# EAGLE design THAT1512  INA128 input NEVIN v4 (EAGLE 9.6.1)
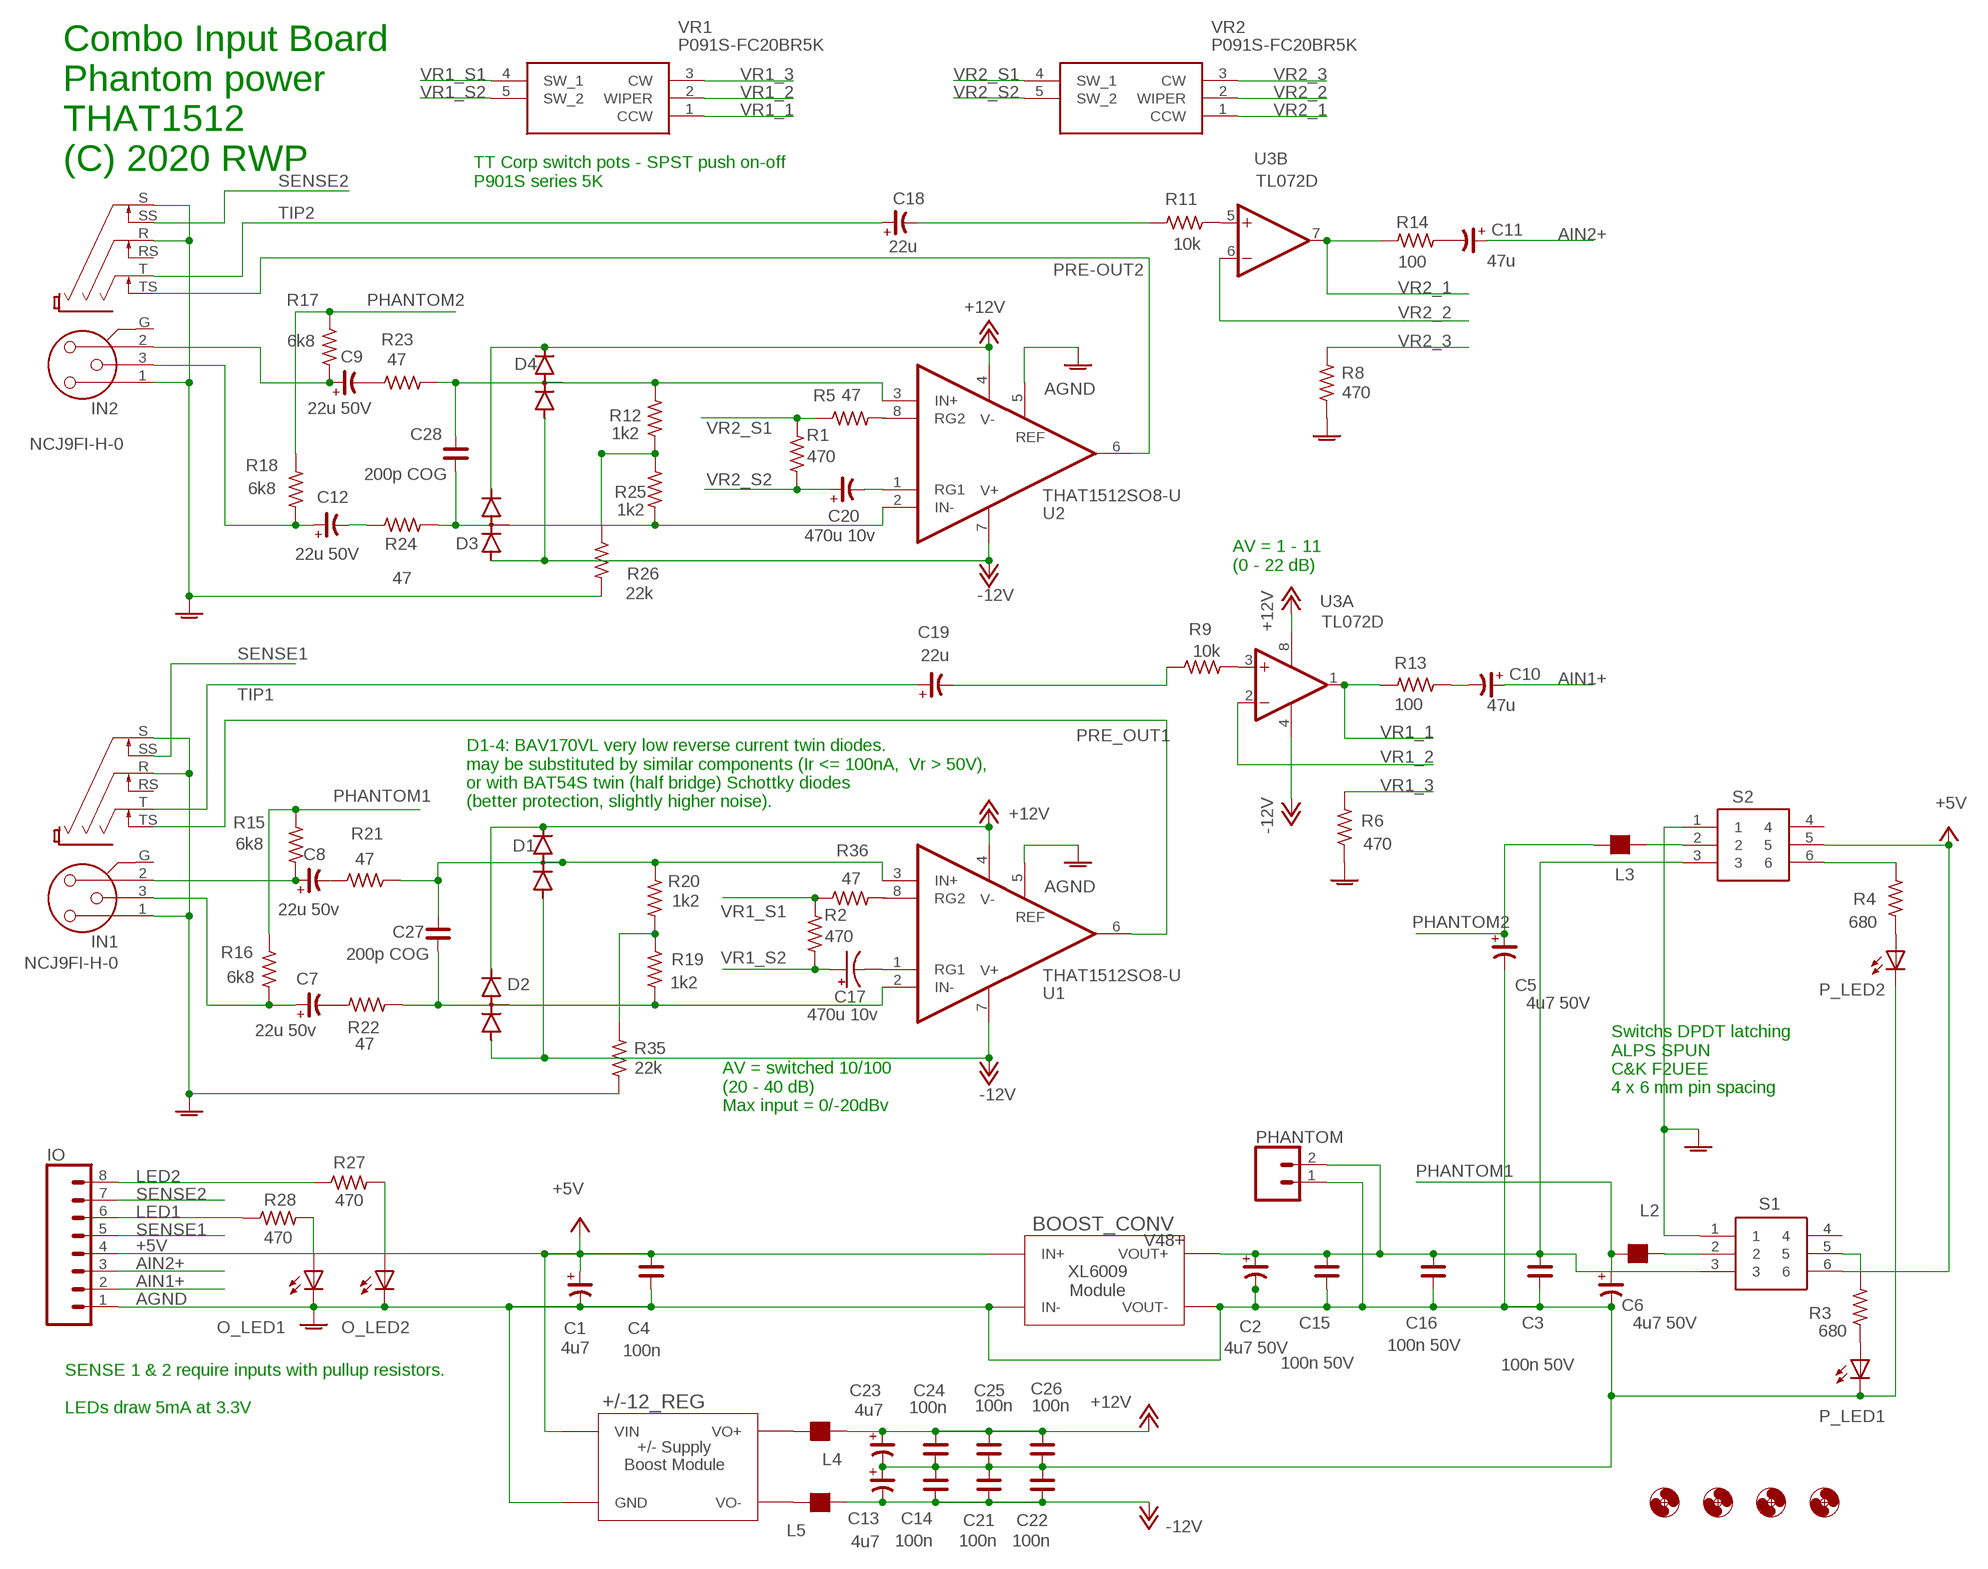
[diagram p0: schematic, sheet 1]

## Parts
+/-12_REG  POS_NEG_SUP_MODULE  [POS_NEG_SUP_MODULE_F]
BOOST_CONV  XL6009_MODULE  [XL6009_MODULE_F]
C1  4u7  CP_3216  [C3216/T]
C2  4u7 50V  CP_3216  [C3216/T]
C3  100n 50V  C_0805  [C0805]
C4  100n  C_0805  [C0805]
C5  4u7 50V  CP_3216  [C3216/T]
C6  4u7 50V  CP_3216  [C3216/T]
C7  22u 50v  CP_SV-C  [CSV-C]
C8  22u 50v  CP_SV-C  [CSV-C]
C9  22u 50V  CP_SV-C  [CSV-C]
C10  47u  CP_SV-B  [CSV-B]
C11  47u  CP_SV-B  [CSV-B]
C12  22u 50V  CP_SV-C  [CSV-C]
C13  4u7  CP_3216  [C3216/T]
C14  100n  C_0805  [C0805]
C15  100n 50V  C_0805  [C0805]
C16  100n 50V  C_0805  [C0805]
C17  470u 10v  CPOL-US153CLV-0605  [153CLV-0605]
C18  22u  CP_SV-B  [CSV-B]
C19  22u  CP_SV-B  [CSV-B]
C20  470u 10v  CP_SV-C  [CSV-C]
C21  100n  C_0805  [C0805]
C22  100n  C_0805  [C0805]
C23  4u7  CP_3216  [C3216/T]
C24  100n  C_0805  [C0805]
C25  100n  C_0805  [C0805]
C26  100n  C_0805  [C0805]
C27  200p COG  C_0805  [C0805]
C28  200p COG  C_0805  [C0805]
D1  HSMS-285C  [SOT323]
D2  HSMS-285C  [SOT323]
D3  HSMS-285C  [SOT323]
D4  HSMS-285C  [SOT323]
H1  MOUNT-HOLE3.6  [3,6]
H2  MOUNT-HOLE3.6  [3,6]
H3  MOUNT-HOLE3.6  [3,6]
H4  MOUNT-HOLE3.6  [3,6]
IN1  NCJ9FI-H-0  [NCJ9FI-H]
IN2  NCJ9FI-H-0  [NCJ9FI-H]
IO  CONN_08"  [1X08]
L2  150  FB_0805  [L0805]
L3  150  FB_0805  [L0805]
L4  150  FB_0805  [L0805]
L5  150  FB_0805  [L0805]
O_LED1  LED3MM  [LED3MM]
O_LED2  LED3MM  [LED3MM]
P_LED1  LED3MM  [LED3MM]
P_LED2  LED3MM  [LED3MM]
PHANTOM  CONN_02  [1X02]
R1  470  R_0805  [R0805]
R2  470  R_0805  [R0805]
R3  680  R_0805  [R0805]
R4  680  R_0805  [R0805]
R5  47  R_0805  [R0805]
R6  470  R_0805  [R0805]
R8  470  R_0805  [R0805]
R9  10k  R_0805  [R0805]
R11  10k  R_0805  [R0805]
R12  1k2  R_0805  [R0805]
R13  100  R_0805  [R0805]
R14  100  R_0805  [R0805]
R15  6k8  R_0805  [R0805]
R16  6k8  R_0805  [R0805]
R17  6k8  R_0805  [R0805]
R18  6k8  R_0805  [R0805]
R19  1k2  R_0805  [R0805]
R20  1k2  R_0805  [R0805]
R21  47  R_0805  [R0805]
R22  47  R_0805  [R0805]
R23  47  R_0805  [R0805]
R24  47  R_0805  [R0805]
R25  1k2  R_0805  [R0805]
R26  22k  R_0805  [R0805]
R27  470  R_0805  [R0805]
R28  470  R_0805  [R0805]
R35  22k  R_0805  [R0805]
R36  47  R_0805  [R0805]
S1  SPUN191600  [SPUN191000]
S2  SPUN191600  [SPUN191000]
U1  THAT1512SO8-U  [SO08]
U2  THAT1512SO8-U  [SO08]
U3  TL072D  [SO08]
VR1  P091S-FC20BR5K  [P091SFC20BR5K]
VR2  P091S-FC20BR5K  [P091SFC20BR5K]

## Nets
+5V [power]: +/-12_REG.IN+(VIN) BOOST_CONV.IN+ C1.+ C4.2 IO.4 S1.6 S2.5
+12V: C23.+ C24.2 C25.2 C26.2 D1.2(C) D2.2(C) D3.2(C) D4.2(C) L4.1 U1.4(V-) U2.4(V-) U3.8(P:V+)
-12V: C13.- C14.1 C21.1 C22.1 D1.1(A) D2.1(A) D3.1(A) D4.1(A) L5.1 U1.7(V+) U2.7(V+) U3.4(P:V-)
AGND: +/-12_REG.GND +/-12_REG.GND@1(GND) BOOST_CONV.IN- BOOST_CONV.VOUT- C1.- C2.- C3.1 C4.1 C5.- C6.- C13.+ C14.2 C15.1 C16.1 C21.2 C22.2 C23.- C24.1 C25.1 C26.1 IN1.1 IN1.R IN1.S IN2.1 IN2.R IN2.S IO.1 O_LED1.K(C) O_LED2.K(C) P_LED1.K(C) P_LED2.K(C) PHANTOM.1 R6.2 R8.2 R26.2 R35.2 S1.1 S2.1 U1.5(REF) U2.5(REF)
AIN1+: C10.+ IO.2
AIN2+: C11.+ IO.3
LED1: IO.6 R28.2
LED2: IO.8 R27.2
N$1: C27.2 D1.3(AC) R20.1 R21.1 U1.3(IN+)
N$3: C27.1 D2.3(AC) R19.2 R22.1 U1.2(IN-)
N$4: C28.2 D4.3(AC) R12.1 R23.1 U2.3(IN+)
N$5: R36.2 U1.8(RG2)
N$6: L2.1 S1.2
N$7: P_LED1.A R3.1
N$8: L3.1 S2.2
N$9: R9.1 U3.3(A:+IN)
N$10: P_LED2.A R4.1
N$14: R11.1 U3.5(B:+IN)
N$15: R5.2 U2.8(RG2)
N$16: R3.2 S1.5
N$18: R4.2 S2.6
N$19: C18.- R11.2
N$20: +/-12_REG.VO- L5.2
N$21: C7.- R22.2
N$22: +/-12_REG.VO+ L4.2
N$25: C11.- R14.1
N$26: C10.- R13.1
N$27: C7.+ IN1.3 R16.1
N$28: C8.- R21.2
N$29: C8.+ IN1.2 R15.1
N$30: C9.- R23.2
N$31: C12.- R24.2
N$32: C9.+ IN2.2 R17.1
N$33: C12.+ IN2.3 R18.1
N$34: C28.1 D3.3(AC) R24.1 R25.2 U2.2(IN-)
N$36: C19.- R9.2
N$37: O_LED1.A R28.1
N$38: O_LED2.A R27.1
N$39: R19.1 R20.2 R35.1
N$41: C17.- U1.1(RG1)
N$43: C20.- U2.1(RG1)
N$45: R12.2 R25.1 R26.1
PHANTOM1: C6.+ L2.2 R15.2 R16.2
PHANTOM2: C5.+ L3.2 R17.2 R18.2
PRE-OUT2: IN2.TS U2.6(OUT)
PRE_OUT1: IN1.TS U1.6(OUT)
SENSE1: IN1.SS IO.5
SENSE2: IN2.SS IO.7
TIP1: C19.+ IN1.T
TIP2: C18.+ IN2.T
V48+ [power]: BOOST_CONV.VOUT+ C2.+ C3.2 C15.2 C16.2 PHANTOM.2 S1.3 S2.3
VR1_1: R13.2 U3.1(A:OUT) VR1.1(CCW)
VR1_2: U3.2(A:-IN) VR1.2(WIPER)
VR1_3: R6.1 VR1.3(CW)
VR1_S1: R2.1 R36.1 VR1.4(SW_1)
VR1_S2: C17.+ R2.2 VR1.5(SW_2)
VR2_1: R14.2 U3.7(B:OUT) VR2.1(CCW)
VR2_2: U3.6(B:-IN) VR2.2(WIPER)
VR2_3: R8.1 VR2.3(CW)
VR2_S1: R1.1 R5.1 VR2.4(SW_1)
VR2_S2: C20.+ R1.2 VR2.5(SW_2)
Unconnected: IN1.G IN1.RS IN2.G IN2.RS S1.4 S2.4

## Notes on the sheet
- Combo Input Board
  Phantom power
  THAT1512
  (C) 2020 RWP
- TT Corp switch pots - SPST push on-off
  P901S series 5K
- AV = 1 - 11 
  (0 - 22 dB)
- D1-4: BAV170VL very low reverse current twin diodes. 
  may be substituted by similar components (Ir <= 100nA,  Vr > 50V), 
  or with BAT54S twin (half bridge) Schottky diodes 
  (better protection, slightly higher noise).
- Switchs DPDT latching
  ALPS SPUN
  C&K F2UEE  
  4 x 6 mm pin spacing
- AV = switched 10/100
  (20 - 40 dB)
  Max input = 0/-20dBv
- SENSE 1 & 2 require inputs with pullup resistors.
  
  LEDs draw 5mA at 3.3V

## Library data of the parts
+/-12_REG = pos_Neg_supply_module:POS_NEG_SUP_MODULE
BOOST_CONV = XL6009_module:XL6009_MODULE
C1 C2 C5-C13 C18-C20 C23 = rc-master-smd:CP_: POLARIZED CAP
C3 C4 C14-C16 C21 C22 C24-C28 = rc-master-smd:C_: NON-POLARIZED CAP
C17 = rcl:CPOL-US: POLARIZED CAPACITOR, American symbol; SPICEPREFIX: C
D1-D4 = avago:HSMS-285C: Surface Mount Microwave Schottky Detector Diodes Source: Data sheet <http://www.farnell.com/datasheets/461166.pdf>
H1-H4 = holes:MOUNT-HOLE: MOUNTING HOLE with drill center marker
IN1 IN2 = con-neutrik_xlr_2:NCJ9FI: NCJ9FI Combination - 3 pin Female XLR - 3 pin 1/4" switched socket Combo I series Without or without retention latch Source: www.neutrik.com/
IO = SparkFun-Connectors:CONN_08: Multi connection point. Often used as Generic Header-pin footprint for 0.1 inch spaced/style header connections On any of the 0.1 inch spaced packages, you can populate with these: Break Away Headers - Straight <https://www.sparkfun.com/products/116> (PRT-00116) Break Away Male Headers - Right Angle <https://www.sparkfun.com/products/553> (PRT-00553) Female Headers <https://www.sparkfun.com/products/115> (PRT-00115) Break Away Headers - Machine Pin <https://www.sparkfun.com/products/117> (PRT-00117) Break Away Female Headers - Swiss Machine Pin <https://www.sparkfun.com/products/743> (PRT-00743) Arduino Stackable Header - 8 Pin <https://www.sparkfun.com/products/9279> (PRT-09279) For SCREWTERMINALS and SPRING TERMINALS visit here: Screw Terimnals on SparkFun.com <https://www.sparkfun.com/search/results?term=Screw+Terminals> (5mm/3.5mm/2.54mm spacing) This device is also useful as a general connection point to wire up your design to another part of your project. Our various solder wires solder well into these plated through hole pads. Hook-Up Wire - Assortment (Stranded, 22 AWG) <https://www.sparkfun.com/products/11375> (PRT-11375) Hook-Up Wire - Assortment (Solid Core, 22 AWG) <https://www.sparkfun.com/products/11367> (PRT-11367) View the entire wire category on our website here <https://www.sparkfun.com/categories/141> Special notes: Molex polarized connector foot print use with SKU : PRT-08231 with associated crimp pins and housings. 1MM SMD Version SKU: PRT-10208 NOTES ON THE VARIANTS LOCK and LOCK_LONGPADS... This footprint was designed to help hold the alignment of a through-hole component (i.e. 6-pin header) while soldering it into place. You may notice that each hole has been shifted either up or down by 0.005 of an inch from it's more standard position (which is a perfectly straight line). This slight alteration caused the pins (the squares in the middle) to touch the edges of the holes. Because they are alternating, it causes a "brace" to hold the component in place. 0.005 has proven to be the perfect amount of "off-center" position when using our standard breakaway headers. Although looks a little odd when you look at the bare footprint, once you have a header in there, the alteration is very hard to notice. Also,if you push a header all the way into place, it is covered up entirely on the bottom side.; PROD_ID: CONN-08438
L2-L5 = rc-master-smd:FB_: FERRITE BEAD
O_LED1 O_LED2 P_LED1 P_LED2 = adafruit:LED: LED OSRAM: - CHIPLED LG R971, LG N971, LY N971, LG Q971, LY Q971, LO R971, LY R971 LH N974, LH R974 LS Q976, LO Q976, LY Q976 LO Q996 - Hyper CHIPLED LW Q18S LB Q993, LB Q99A, LB R99A - SideLED LS A670, LO A670, LY A670, LG A670, LP A670 LB A673, LV A673, LT A673, LW A673 LH A674 LY A675 LS A676, LA A676, LO A676, LY A676, LW A676 LS A679, LY A679, LG A679 - Hyper Micro SIDELED® LS Y876, LA Y876, LO Y876, LY Y876 LT Y87S - SmartLED LW L88C, LW L88S LB L89C, LB L89S, LG L890 LS L89K, LO L89K, LY L89K LS L896, LA L896, LO L896, LY L896 - TOPLED LS T670, LO T670, LY T670, LG T670, LP T670 LSG T670, LSP T670, LSY T670, LOP T670, LYG T670 LG T671, LOG T671, LSG T671 LB T673, LV T673, LT T673, LW T673 LH T674 LS T676, LA T676, LO T676, LY T676, LB T676, LH T676, LSB T676, LW T676 LB T67C, LV T67C, LT T67C, LS T67K, LO T67K, LY T67K, LW E67C LS E67B, LA E67B, LO E67B, LY E67B, LB E67C, LV E67C, LT E67C LW T67C LS T679, LY T679, LG T679 LS T770, LO T770, LY T770, LG T770, LP T770 LB T773, LV T773, LT T773, LW T773 LH T774 LS E675, LA E675, LY E675, LS T675 LS T776, LA T776, LO T776, LY T776, LB T776 LHGB T686 LT T68C, LB T68C - Hyper Mini TOPLED® LB M676 - Mini TOPLED Santana® LG M470 LS M47K, LO M47K, LY M47K Source: http://www.osram.convergy.de/
PHANTOM = SparkFun-Connectors:CONN_02: Multi connection point. Often used as Generic Header-pin footprint for 0.1 inch spaced/style header connections On any of the 0.1 inch spaced packages, you can populate with these: Break Away Headers - Straight <https://www.sparkfun.com/products/116> (PRT-00116) Break Away Male Headers - Right Angle <https://www.sparkfun.com/products/553> (PRT-00553) Female Headers <https://www.sparkfun.com/products/115> (PRT-00115) Break Away Headers - Machine Pin <https://www.sparkfun.com/products/117> (PRT-00117) Break Away Female Headers - Swiss Machine Pin <https://www.sparkfun.com/products/743> (PRT-00743) For SCREWTERMINALS and SPRING TERMINALS visit here: Screw Terimnals on SparkFun.com <https://www.sparkfun.com/search/results?term=Screw+Terminals> (5mm/3.5mm/2.54mm spacing) This device is also useful as a general connection point to wire up your design to another part of your project. Our various solder wires solder well into these plated through hole pads. Hook-Up Wire - Assortment (Stranded, 22 AWG) <https://www.sparkfun.com/products/11375> (PRT-11375) Hook-Up Wire - Assortment (Solid Core, 22 AWG) <https://www.sparkfun.com/products/11367> (PRT-11367) View the entire wire category on our website here <https://www.sparkfun.com/categories/141> Special notes: Molex polarized connector foot print use with: PRT-08233 with associated crimp pins and housings. 2.54_SCREWTERM for use with PRT-10571. 3.5mm Screw Terminal footprints for PRT-08084 5mm Screw Terminal footprints for use with PRT-08432
R1-R6 R8 R9 R11-R28 R35 R36 = rc-master-smd:R_: RESISTOR
S1 S2 = SamacSys_Parts:SPUN191600: Double Pole Double Throw (DPDT) Latching Push Button Switch, PCB Source: Datasheet <https://componentsearchengine.com/Datasheets/1/SPUN191600.pdf>; DESCRIPTION: Double Pole Double Throw (DPDT) Latching Push Button Switch, PCB; HEIGHT: mm; MANUFACTURER_NAME: ALPS; MANUFACTURER_PART_NUMBER: SPUN191600; MOUSER_PART_NUMBER: 688-SPUN191600; MOUSER_PRICE-STOCK: https://www.mouser.com/Search/Refine.aspx?Keyword=688-SPUN191600
U1 U2 = that-corp:THAT1512: Audio Preamplifier IC, Low Noise, High Performance
U3 = linear:TL072: OP AMP
VR1 VR2 = SamacSys_Parts:P091S-FC20BR5K: POTENTIOMETER Source: Datasheet <https://componentsearchengine.com/Datasheets/1/P091S-FC20BR5K.pdf>; DESCRIPTION: POTENTIOMETER; HEIGHT: 11.35mm; MANUFACTURER_NAME: BI Technologies; MANUFACTURER_PART_NUMBER: P091S-FC20BR5K; MOUSER_PART_NUMBER: 858-P091SFC20BR5K; MOUSER_PRICE-STOCK: https://www.mouser.com/Search/Refine.aspx?Keyword=858-P091SFC20BR5K

## Net classes
3 power: width 0.406 mm

## Board
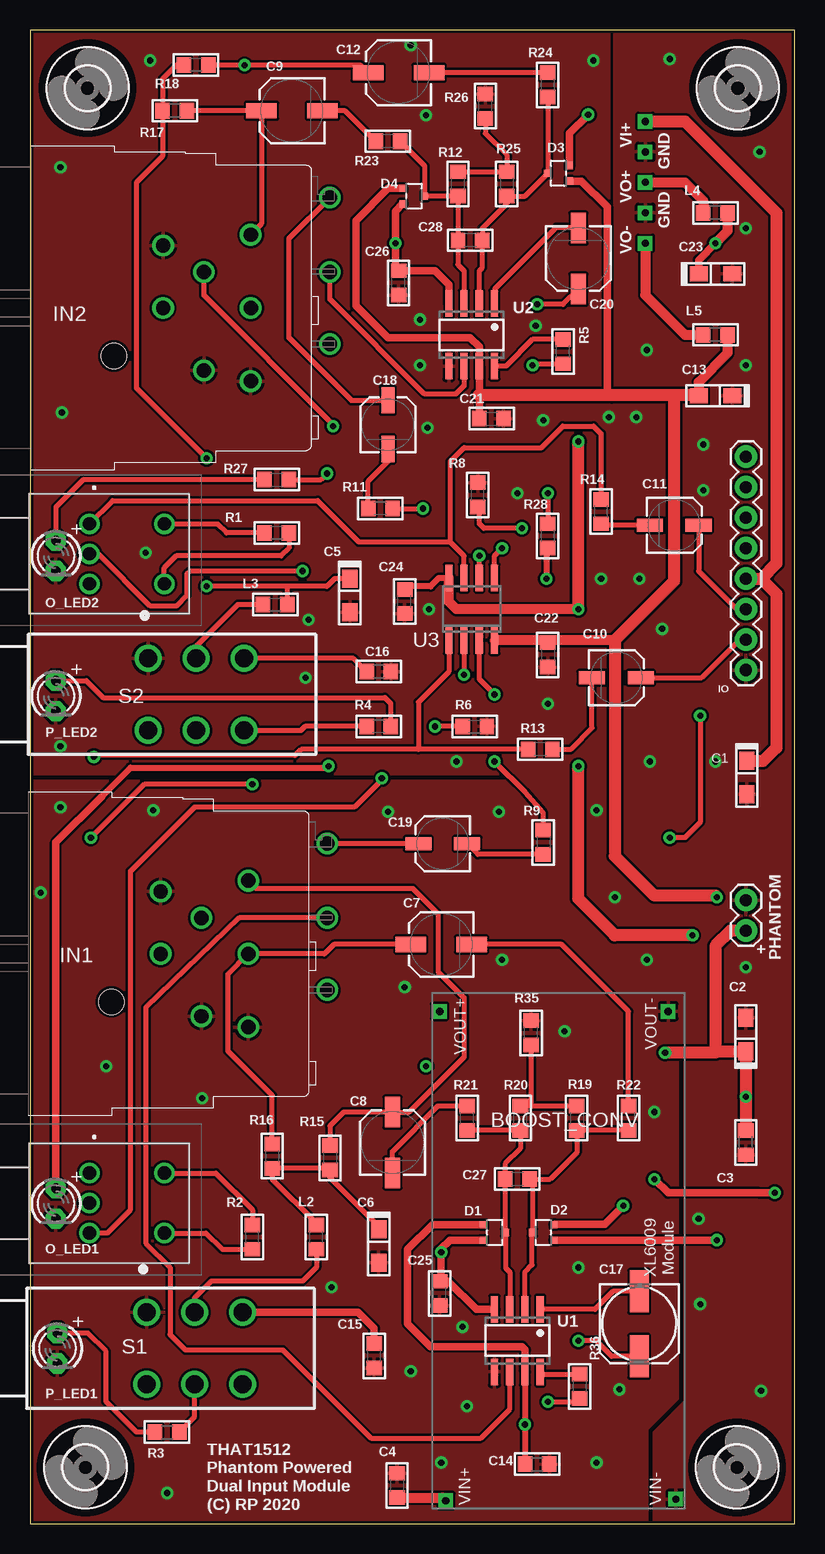
[diagram p1: board, top side]
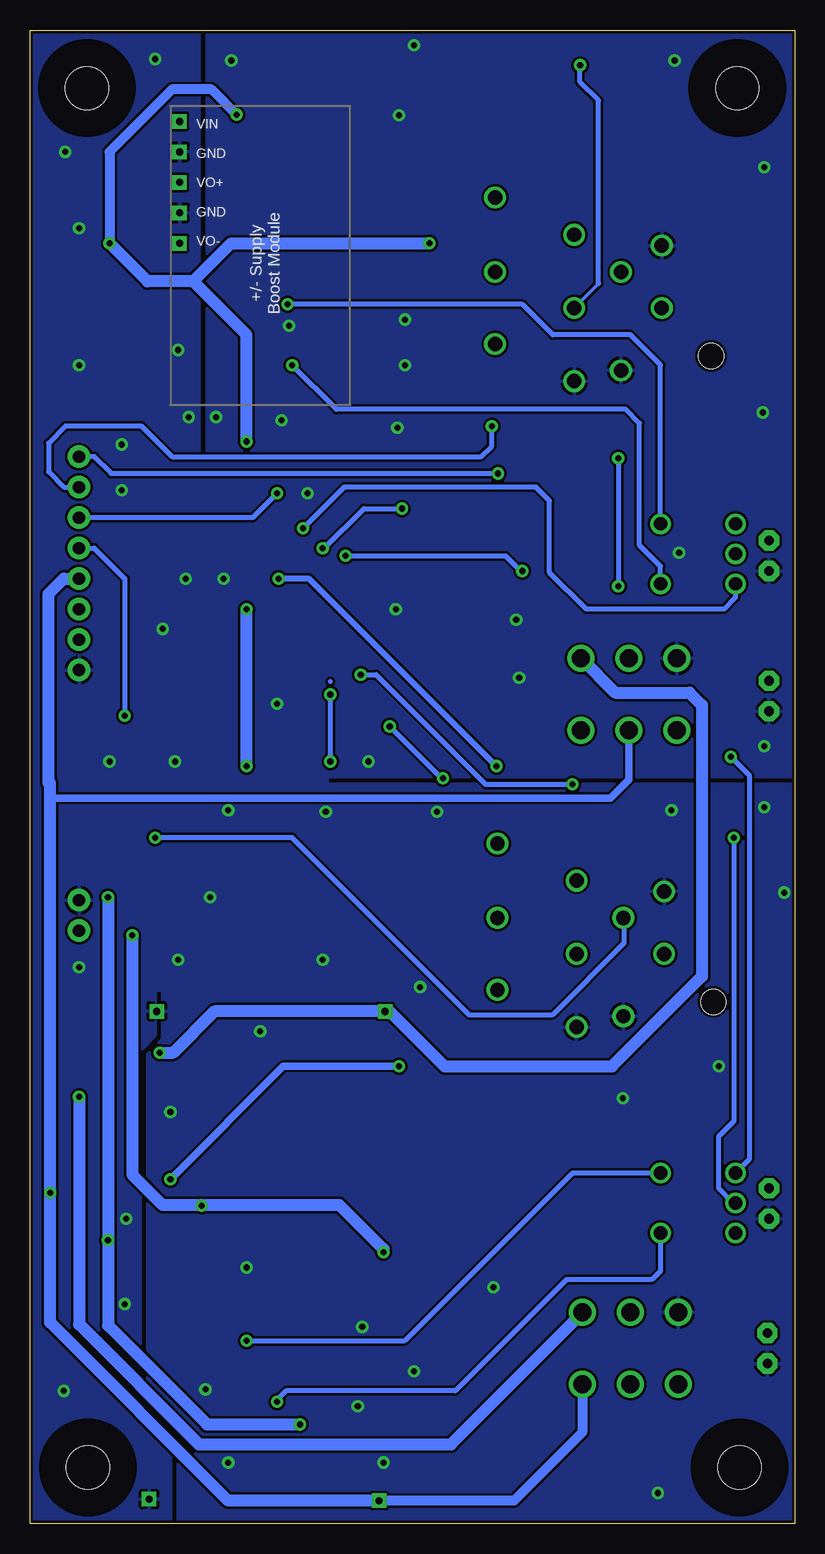
[diagram p2: board, bottom side, seen from below]

Size 63.78 x 124.46 mm. Coordinates in mm from the lower left corner, seen from the top.
Outline: 0,0 63.78,0 63.78,124.46 0,124.46 0,0
Copper layers (1*16): Top 0.035mm / dielectric 1.5mm / Bottom 0.035mm
Design rules "SparkFun": minimum track width 8mil, minimum drill 20mil, track to track 8mil, track to pad 8mil, pad to pad 8mil, via to via 8mil, smd to smd 8mil, copper to edge 10mil, drill to drill 8mil, minimum pad ring 12mil, minimum via ring 10mil, stop-mask expansion 4mil, vias tented up to drill 25mil, thermal gap 10mil

### Footprints (pad centres in the part's own frame; a part is rotated, then mirrored left to right if it is on the bottom)
POS_NEG_SUP_MODULE_F = drill 0.6 square: GND 3.81,0.762; GND@1 8.89,0.762; IN+ 1.27,0.762; VO+ 6.35,0.762; VO- 11.43,0.762
XL6009_MODULE_F = drill 0.6 square: IN+ 0.635,19.939; IN- 0.762,0.762; VOUT+ 41.402,20.447; VOUT- 41.402,1.397
C3216/T = smd 1.5 x 1.27: + 1.397,0; - -1.397,0
C0805 = smd 1.2 x 1.3: 1 -1.016,0; 2 1.016,0
CSV-C = smd 2.54 x 1.27: + -2.54,0; - 2.54,0
CSV-B = smd 2.184 x 1.067: + -2.032,0; - 2.032,0
153CLV-0605 = smd 3.5 x 1.6: + 2.7,0; - -2.7,0
SOT323 = smd 0.6 x 0.55: 1 -0.65,-0.925; 2 0.65,-0.925; 3 0,0.925
3,6 = hole 3.6: 0,0
NCJ9FI-H = drill 1.2: 1 -6.1,-18.4; 2 6.1,-18.4; 3 0,-18.4; G 0,-11.1; R -5.2,-14.5; RS -3,-25; S 5.2,-11.1; SS 3,-14.5; T 9.2,-25; TS 3,-25 | hole 2.1: -4,-7
1X08 = drill 1.016 pad 1.88: 1 0,0; 2 2.54,0; 3 5.08,0; 4 7.62,0; 5 10.16,0; 6 12.7,0; 7 15.24,0; 8 17.78,0
L0805 = smd 1.2 x 1.3: 1 -1.016,0; 2 1.016,0
LED3MM = drill 0.813 pad 1.676 octagon: A -1.27,0; K 1.27,0
1X02 = drill 1.016 pad 1.88: 1 0,0; 2 2.54,0
R0805 = smd 1.2 x 1.3: 1 -1.016,0; 2 1.016,0
SPUN191000 = drill 1.5 pad 2.25: 1 3,-19.5; 2 3,-23.5; 3 3,-27.5; 4 -3,-19.5; 5 -3,-23.5; 6 -3,-27.5
SO08 = smd 0.6 x 2.2: 1 -1.905,-2.6; 2 -0.635,-2.6; 3 0.635,-2.6; 4 1.905,-2.6; 5 1.905,2.6; 6 0.635,2.6; 7 -0.635,2.6; 8 -1.905,2.6
P091SFC20BR5K = drill 1.1 pad 1.65: 1 0,0; 2 0,2.5; 3 0,5; 4 -6.25,5; 5 -6.25,0

### Placement (x,y rotation side)
+/-12_REG  52.07,118.11 270 bottom
BOOST_CONV  54.61,1.27 90 top
C1  59.77,62.15 90 top
C2  59.69,40.77 270 top
C3  59.69,31.75 90 top
C4  30.61,3.17 270 top
C5  26.67,77.34 90 top
C6  29.08,23.11 90 top
C7  34.29,48.26 0 top
C8  30.23,31.75 270 top
C9  21.84,117.73 0 top
C10  48.9,70.48 180 top
C11  53.72,83.19 180 top
C12  30.73,120.9 0 top
C13  57.15,93.98 0 top
C14  42.29,4.95 0 top
C15  28.7,13.97 90 top
C16  29.08,70.99 180 top
C17  50.8,16.64 270 top
C18  29.84,91.57 270 top
C19  34.42,56.64 0 top
C20  45.72,105.41 90 top
C21  38.48,92.07 0 top
C22  43.18,72.39 270 top
C23  57.15,104.14 180 top
C24  31.24,76.84 90 top
C25  34.16,19.18 90 top
C26  30.73,103.38 90 top
C27  40.64,28.7 180 top
C28  36.7,106.93 180 top
D1  38.73,24.26 270 top
D2  42.8,24.26 90 top
D3  44.07,112.52 90 top
D4  32,110.62 270 top
H1  4.62,4.67 0 top
H2  4.8,119.61 0 top
H3  59.03,119.61 0 top
H4  58.95,4.67 0 top
IN1  -0.2,47.47 90 top
IN2  0,101.3 90 top
IO  59.69,71.12 90 top
L2  23.88,23.88 90 top
L3  20.45,76.58 0 top
L4  57.15,109.22 180 top
L5  57.15,99.06 180 top
O_LED1  2.16,26.67 270 top
O_LED2  2.16,80.65 270 top
P_LED1  2.29,14.61 270 top
P_LED2  2.16,68.96 270 top
PHANTOM  59.69,51.94 270 top
R1  20.57,82.55 180 top
R2  18.54,23.88 90 top
R3  11.43,7.62 0 top
R4  29.08,66.42 180 top
R5  44.45,97.66 90 top
R6  37.08,66.42 0 top
R8  37.34,85.72 90 top
R9  42.8,56.77 270 top
R11  29.21,84.58 180 top
R12  35.69,111.63 90 top
R13  42.55,64.52 180 top
R14  47.62,84.33 90 top
R15  25.02,30.48 270 top
R16  20.19,30.61 270 top
R17  12.06,117.73 180 top
R18  13.84,121.54 180 top
R19  45.59,33.78 270 top
R20  40.89,33.78 90 top
R21  36.45,33.78 90 top
R22  49.91,33.78 90 top
R23  29.84,115.19 180 top
R24  43.18,119.89 90 top
R25  39.75,111.63 270 top
R26  37.97,118.11 90 top
R27  20.57,87 0 top
R28  43.18,82.3 90 top
R35  41.78,40.89 90 top
R36  45.85,11.43 90 top
S1  -9.78,14.61 90 top
S2  -9.65,69.09 90 top
U1  40.64,15.24 180 top
U2  36.83,99.06 180 top
U3  36.83,76.2 0 top
VR1  4.95,29.21 180 top
VR2  4.95,83.31 180 top

### Tracks (layer width: path | path; a pad name or v marks a point on that pad's centre or on a via)
+5V  (via drill 0.51)
  Top 0.61: 34.42,2.16 BOOST_CONV.IN+ | 60.83,27.56 53.21,27.56 v52.07,28.7 | 60.83,27.56 v62.1,27.56 | 60.83,27.56
  Top 0.813: C4.2 34.42,2.16
  Top 1.016: +/-12_REG.IN+ 54.61,116.84 62.23,109.22 62.23,80.01 60.96,78.74 | IO.4 60.96,78.74 | 60.96,78.74 62.23,77.47 62.23,64.64 61.14,63.55 C1.+
  Bottom 0.61: S2.5 13.85,61.97 15.37,60.45 62.1,60.45 | 62.1,61.72 62.23,61.72 | v33.02,38.1 42.67,38.1 v52.07,28.7
  Bottom 0.813: BOOST_CONV.IN+ 23.42,1.9 17.72,7.6 S1.6
  Bottom 1.016: BOOST_CONV.IN+ 47.24,1.9 62.1,16.76 v62.1,27.56 62.1,60.45 62.1,61.72 | IO.4 60.96,78.74 62.23,77.47 62.23,61.72
+12V  (via drill 0.51)
  Top 0.508: C24.2 31.5,78.1 33.4,78.1 34.1,78.8 U3.8
  Top 0.61: C23.+ 55.75,105.28 v57.15,106.68 | U1.4 37.21,17.84 34.86,20.19 C25.2 34.29,20.32 v34.29,22.61 34.29,22.88 35.01,23.61 D1.2 | v49.46,26.48 47.94,24.95 43.77,24.95 D2.2 | D4.2 30.48,109.37 v30.48,106.68 30.48,104.65 C26.2 33.78,104.39 34.92,103.25 U2.4 | v46.55,117.41 44.99,115.86 D3.2
  Top 0.813: L4.1 58.17,107.7 v57.15,106.68 | U3.8 34.92,76.84 35.56,76.2 v45.72,76.2
  Top 1.016: v45.72,63.12 45.72,52.07 48.77,49.02 v55.24,49.02 | v45.72,76.2 v45.72,90.17
  Bottom 0.406: 49.53,26.54 v49.46,26.48
  Bottom 0.813: v46.55,117.41 48.64,119.51 51.94,119.51 57.15,114.3 v57.15,106.68
  Bottom 1.016: v30.48,106.68 46.99,106.68 50.16,103.5 | 50.16,103.5 53.98,103.5 v57.15,106.68 | v34.29,22.61 34.29,22.86 37.97,26.54 49.53,26.54 52.7,26.54 55.24,29.08 v55.24,49.02 | v45.72,63.12 v45.72,76.2 | 50.16,103.5 45.72,99.06 v45.72,90.17
-12V  (via drill 0.51)
  Top 0.406: 55.82,94.04 C13.-
  Top 0.508: U1.7 v41.27,8.25 C14.1
  Top 0.61: D3.1 45.99,111.87 48.13,109.73 48.13,94.04 | D1.1 33.54,24.91 31.5,22.86 31.5,16.64 33.4,14.73 41.02,14.73 41.27,14.48 U1.7 | 37.47,94.11 U2.7 37.47,98.04 36.7,98.81 29.84,98.81 27.18,101.47 27.18,108.59 29.86,111.27 D4.1 | 37.47,94.11 37.4,94.04 | 37.47,94.11 C21.1 | v57.28,23.62 57.26,23.61 D2.1
  Top 0.813: L5.1 58.17,97.54 55.75,95.12 C13.- | 57.15,52.32 v57.28,52.2 | 48.77,73.6 43.16,73.6 | 43.16,73.6 U3.4 | C22.1 43.16,73.6
  Top 1.016: 37.4,94.04 48.13,94.04 53.72,94.04 | 57.15,52.32 52.07,52.32 48.77,55.63 48.77,73.6 53.72,78.55 53.72,94.04 | 53.72,94.04 55.82,94.04
  Bottom 1.016: v41.27,8.25 49.02,8.25 57.28,16.51 v57.28,23.62 v57.28,52.2
AGND  (via drill 0.51)
  other vias: 2.67,92.58 2.54,113.03 10.03,121.92 31.75,123.19 46.99,121.92 53.34,122.05 60.83,114.3 59.69,96.52 57.15,63.5 59.69,46.35 60.96,11.05 55.88,18.29 11.43,2.54 36.45,9.78 6.35,38.1 0.89,52.58 2.54,59.69 39.37,46.99 39.12,59.31 43.18,68.33 44.58,41.02 52.07,34.29 55.75,25.4 49.15,11.18 47.24,5.08 51.44,46.99 59.69,107.95 51.44,97.79 56.13,89.92 33.27,76.2 25.15,19.69 14.35,35.43 36.07,16.38 34.29,5.08 33.15,91.31 42.8,91.95 33.02,117.35 52.7,74.55 47.24,59.44 51.69,63.5 50.55,92.2 2.54,64.77 50.8,78.74 42.16,99.82 32.51,100.33 32.51,96.52 47.62,78.74 56.13,86.11 45.72,21.34 48.77,52.2 31.24,44.7 31.75,12.7 23.24,75.31 40.64,85.85 48.26,92.2 9.65,80.9 29.84,59.31 10.29,59.44 35.56,63.5 22.99,70.48
  pour Top (rank 3): 63.5,60.96 48.77,60.96 48.77,124.46 63.5,124.46
  pour Top (rank 2): 0,0 51.44,0 51.44,7.87 53.98,10.41 53.98,61.85 0,61.85
  pour Top (rank 2): 0,124.46 48.26,124.46 48.26,62.48 0,62.48
  pour Top: 40.26,93.34 57.15,93.34 57.15,39.5 40.26,39.5
  pour Top (rank 3): 52.07,0 63.5,0 63.5,66.04 54.61,66.04 54.61,10.16 52.07,7.62
  pour Bottom: 52.07,0 63.75,0 63.75,62.23 53.34,62.23 53.34,40.64 54.61,39.37 54.61,10.16 52.07,7.62
  pour Bottom (rank 2): 38.99,90.3 57.15,90.3 57.15,44.45 38.99,44.45
  pour Bottom: 63.75,60.96 49.66,60.96 49.66,124.46 63.75,124.46
  pour Bottom: 0,124.46 49.02,124.46 49.02,62.23 0,62.23
  pour Bottom: 0,0 51.44,0 51.44,7.87 53.98,10.41 53.98,39.12 52.7,40.39 52.7,61.59 0,61.59
AIN1+
  Top 0.406: IO.2 59.18,73.66 56.01,70.48 C10.+
AIN2+
  Top 0.406: IO.3 58.93,76.2 55.75,79.38 C11.+
LED1  (via drill 0.51)
  Top 0.406: v43.18,85.85 R28.2
  Bottom 0.406: IO.6 45.21,83.82 v43.18,85.85
LED2  (via drill 0.51)
  Top 0.406: R27.2 24.26,87 v24.77,87.5
  Bottom 0.406: v24.77,87.5 57.02,87.5 58.42,88.9 IO.8
N$1
  Top 0.406: U1.3 40.01,20.95 39.66,21.3 D1.3 39.62,24.29 C27.2 39.62,29.97 40.89,31.24 R20.1 R21.1
N$3
  Top 0.406: U1.2 41.27,20.95 41.87,21.55 D2.3 41.91,24.29 41.91,28.45 C27.1 43.39,28.7 45.59,30.9 R19.2 R22.1
N$4
  Top 0.406: U2.3 36.2,104.39 35.69,104.9 C28.2 R12.1 D4.3 32.9,110.62 32.9,113.15 R23.1
N$5
  Top 0.406: U1.8 42.74,12.45 R36.2
N$6
  Top 0.406: L2.1 23.88,21.34 22.73,20.19 15.11,20.19 13.72,18.8 S1.2
N$7
  Top 0.406: R3.1 8.89,7.62 6.35,10.16 6.35,14.35 4.83,15.88 P_LED1.A
N$8
  Top 0.406: S2.2 13.85,73.1 17.32,76.58 L3.1
N$9  (via drill 0.51)
  Top 0.406: v38.73,69.09 37.47,70.36 U3.3 | R9.1 42.8,59.22 41.27,60.96 v38.73,63.5
  Bottom 0.406: v38.73,63.5 v38.73,69.09 | 38.73,70.17
N$10
  Top 0.406: R4.1 30.1,68.33 29.59,68.83 6.1,68.83 4.7,70.23 P_LED2.A
N$14  (via drill 0.51)
  Top 0.406: U3.5 38.73,80.65 v39.37,81.28 | R11.1 v32.77,84.58
  Bottom 0.406: v39.37,81.28 39.24,81.28 35.94,84.58 v32.77,84.58
N$15
  Top 0.406: R5.2 41.91,98.68 39.69,96.46 U2.8
N$16
  Top 0.406: R3.2 13.72,8.89 S1.5
N$18
  Top 0.406: R4.2 22.93,66.42 22.59,66.09 S2.6
N$19
  Top 0.406: R11.2 28.19,86.87 29.84,88.52 C18.-
N$20
  Top 0.813: +/-12_REG.VO- 51.31,102.36 54.61,99.06 L5.2
N$21
  Top 0.406: R22.2 49.91,42.67 44.32,48.26 C7.-
N$22
  Top 0.813: +/-12_REG.VO+ 54.61,111.76 56.13,110.24 L4.2
N$25
  Top 0.406: C11.- 47.63,83.19 R14.1
N$26
  Top 0.406: R13.1 45.09,64.52 46.86,66.29 C10.-
N$27
  Top 0.406: R16.1 20.19,35.69 16.51,39.37 16.51,45.79 IN1.3 24.55,47.47 25.33,48.26 C7.+
N$28
  Top 0.406: C8.- 30.23,30.99 34.04,34.8 R21.2
N$29
  Top 0.406: R15.1 25.02,33.15 26.16,34.29 C8.+ 31.62,34.29 36.2,38.86 36.2,43.81 34.04,45.97 34.04,50.8 31.9,52.94 18.83,52.94 IN1.2
N$30
  Top 0.406: R23.2 26.29,117.73 C9.-
N$31
  Top 0.406: R24.2 C12.-
N$32
  Top 0.406: R17.1 C9.+ 19.3,108.3 IN2.2
N$33  (via drill 0.51)
  Top 0.406: R18.1 v17.91,121.54 27.56,121.54 C12.+
  Bottom 0.305: IN2.3 16.38,103.32
  Bottom 0.406: 16.38,103.32 16.38,118.59 17.91,120.12 v17.91,121.54
N$34
  Top 0.406: R24.1 43.18,112.56 D3.3 43.14,112.49 41.27,110.62 R25.2 39.75,109.98 37.72,107.95 C28.1 37.72,104.65 37.47,104.39 U2.2
N$36
  Top 0.406: R9.2 37.34,55.75 C19.-
N$37  (via drill 0.51)
  Top 0.508: 5.97,60.58 8.38,62.99 24.77,62.99 v24.89,63.12 | R28.1 43.05,81.15 v43.05,78.74
  Top 0.61: O_LED1.A 2.16,56.77 5.97,60.58
  Bottom 0.508: v24.89,63.12 40.51,78.74 v43.05,78.74
N$38
  Top 0.406: R27.1 4.45,87 2.16,84.71 O_LED2.A
N$39
  Top 0.406: 41.78,34.8 R20.2 | R35.1 41.78,34.8 | 41.78,34.8 R19.1
N$41
  Top 0.406: C17.- 48.61,19.34 47.12,17.84 U1.1
N$43
  Top 0.406: C20.- 45.68,107.99 43.86,107.99 38.73,102.87 U2.1
N$45
  Top 0.406: R12.2 R25.1 39.75,114.05 37.97,115.82 R26.1
PHANTOM1
  Top 0.406: L2.2 23.88,25.02 20.19,28.7 R16.2 24.89,29.59 R15.2 25.02,28.83 29.08,24.77 C6.+
PHANTOM2  (via drill 0.51)
  Top 0.406: R18.2 12.19,121.54 11.05,120.4 R17.2 11.05,113.92 8.89,111.76 8.89,94.62 v14.73,88.77 | C5.+ 25.4,78.74 24.77,78.1 21.46,78.1 L3.2 21.46,78.1 v14.73,78.1
  Bottom 0.406: v14.73,88.77 v14.73,78.1
PRE-OUT2
  Top 0.406: IN2.TS 25,102.01 32.9,94.11 35.49,94.11 36.2,94.81 U2.6
PRE_OUT1
  Top 0.406: IN1.TS 17.45,50.47 9.65,43 9.65,23.37 11.68,21.34 11.68,15.75 12.95,14.48 21.08,14.48 28.45,7.11 37.59,7.11 40.01,9.53 U1.6
SENSE1  (via drill 0.51)
  Top 0.406: v55.88,67.31 55.88,58.42 54.61,57.15 v53.34,57.15
  Bottom 0.406: IN1.SS 14.22,50.4 14.22,48.39 20.19,42.42 27.18,42.42 41.91,57.15 v53.34,57.15 | IO.5 58.42,81.28 55.88,78.74 v55.88,67.31
SENSE2  (via drill 0.51)
  Top 0.406: IN2.SS 14.5,102.34 25.27,91.57 v25.27,91.44
  Bottom 0.406: IO.7 60.96,86.36 62.23,87.63 62.23,90.04 60.83,91.44 54.48,91.44 51.94,88.9 26.16,88.9 25.27,89.79 v25.27,91.44
TIP1
  Top 0.406: C19.+ 24.83,56.64 IN1.T
TIP2
  Top 0.406: IN2.T 21.59,107.09 21.59,98.81 26.8,93.6 C18.+
V48+  (via drill 0.51)
  Top 0.406: C16.2 26.97,72.09 S2.3
  Top 0.61: C15.2 28.7,16.26 27.35,17.61 S1.3
  Top 1.016: v52.96,39.24 57.15,39.24 57.15,39.37 | 57.15,39.37 C2.+ v59.69,35.56 C3.2 | PHANTOM.2 58.42,49.4 57.15,48.13 57.15,39.37
  Bottom 1.016: v52.96,39.24 51.82,39.24 48.39,42.67 BOOST_CONV.VOUT+ 33.78,42.67 29.21,38.1 15.24,38.1 7.75,45.59 7.75,68.2 8.79,69.25 15.01,69.25 S2.3 | v59.69,35.56 59.69,16.6 49.7,6.6 28.66,6.6 17.72,17.55 S1.3
VR1_1  (via drill 0.51)
  Top 0.406: U3.1 34.92,70.99 32.38,68.45 32.38,64.52 | v5.33,63.88 5.46,64.01 22.1,64.01 22.61,64.52 32.38,64.52 | R13.2 32.38,64.52
  Bottom 0.406: v5.33,63.88 3.81,62.36 3.81,30.35 VR1.1
VR1_2  (via drill 0.51)
  Top 0.406: U3.2 v36.2,70.74 | v18.54,61.59 9.53,61.59 v5.08,57.15
  Bottom 0.406: VR1.2 5.12,26.71 6.35,27.94 6.35,32.26 5.08,33.53 v5.08,57.15 | v36.2,70.74 34.92,70.74 25.78,61.59 v18.54,61.59
VR1_3  (via drill 0.51)
  Top 0.406: R6.1 v33.78,66.42 | v29.34,62.1 29.34,61.98 27.05,59.69 13.72,59.69 8.38,54.36 8.38,26.16 6.43,24.21 VR1.3
  Bottom 0.406: v29.34,62.1 29.46,62.1 v33.78,66.42
VR1_S1  (via drill 0.51)
  Top 0.406: v43.18,10.16 45.59,10.16 R36.1 | VR1.4 14.65,24.21 16,22.86 R2.1
  Bottom 0.406: v43.18,10.16 43.18,10.31 42.44,11.05 28.32,11.05 19.05,20.32 11.94,20.32 11.22,21.04 11.22,24.2 VR1.4
VR1_S2  (via drill 0.51)
  Top 0.406: C17.+ 48.51,13.94 47.21,15.24 v45.72,15.24 | VR1.5 15.49,29.21 18.54,26.16 R2.2
  Bottom 0.406: v45.72,15.24 32.51,15.24 18.54,29.21 VR1.5
VR2_1
  Top 0.406: 35.05,81.87 34.99,81.81 27.41,81.81 23.98,85.24 6.88,85.24 VR2.1 | 35.05,81.87 35.05,88.52 36.2,89.66 42.65,89.66 44.43,91.44 46.99,91.44 47.6,90.83 47.62,90.85 R14.2 | U3.7 36.2,80.65 35.05,81.79 35.05,81.87
VR2_2  (via drill 0.51)
  Top 0.406: U3.6 v37.47,80.65 | VR2.2 5.67,80.81 10.03,76.45 12.19,76.45 13.08,77.34 13.08,79.12 13.34,79.38 v22.73,79.38
  Bottom 0.406: v37.47,80.65 24.13,80.65 22.86,79.38 v22.73,79.38
VR2_3  (via drill 0.51)
  Top 0.406: R8.1 37.47,84.63 37.47,83.31 37.85,82.93 v41.02,82.93
  Bottom 0.406: v41.02,82.93 37.59,86.36 21.59,86.36 20.45,85.22 20.45,79.25 17.4,76.2 5.92,76.2 4.95,77.17 VR2.3
VR2_S1  (via drill 0.51)
  Top 0.406: R1.1 21.59,81.28 20.95,80.65 12.19,80.65 11.2,79.66 VR2.4 | v41.91,96.52 42.04,96.65 R5.1
  Bottom 0.406: VR2.4 11.2,79.78 12.95,81.53 12.95,91.69 14.1,92.84 38.23,92.84 v41.91,96.52
VR2_S2  (via drill 0.51)
  Top 0.406: VR2.5 15.62,83.31 16.38,82.55 R1.2 | C20.+ 44.45,101.6 v42.29,101.6
  Bottom 0.406: VR2.5 11.2,96.55 13.72,99.06 20.19,99.06 22.73,101.6 v42.29,101.6

### Text on the board
tPlace: THAT1512 / Phantom Powered / Dual Input Module / (C) RP 2020
tNames: GND GND | VO- VO+ VI+ | +